# EAGLE design PCB Albert (EAGLE 9.0.1)
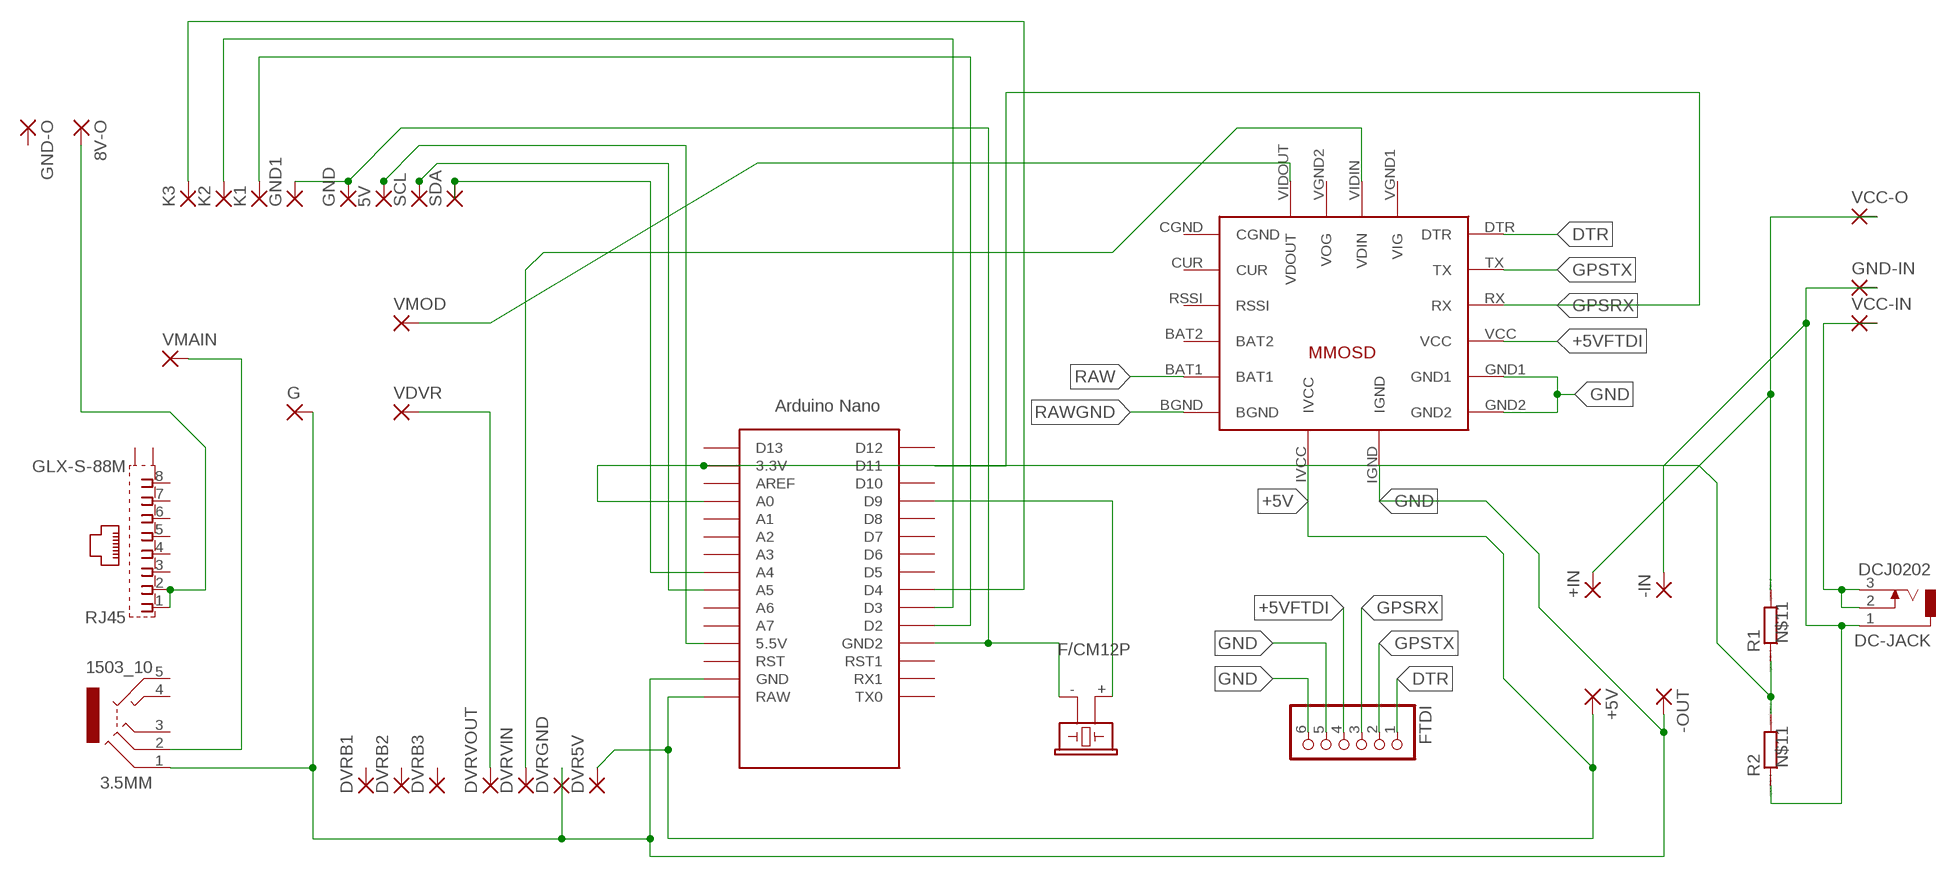
[diagram p0: schematic, sheet 1]

## Parts
3.5MM  1503_10  [1503_10]
5V  SMD2  [SMD1,27-2,54]
8V-O  2,54/1,1  [2,54/1,1]
+5V  SMD2  [SMD1,27-2,54]
+IN  SMD2  [SMD1,27-2,54]
-IN  SMD2  [SMD1,27-2,54]
-OUT  SMD2  [SMD1,27-2,54]
ADRUINO-NANO  NANO  [NANO]
BUZZ  F/CM12P  [F/CM12P]
DC-JACK  DCJ0202  [DCJ0202]
DVR5V  SMD2  [SMD1,27-2,54]
DVRB1  SMD2  [SMD1,27-2,54]
DVRB2  SMD2  [SMD1,27-2,54]
DVRB3  SMD2  [SMD1,27-2,54]
DVRGND  SMD2  [SMD1,27-2,54]
DVRVIN  SMD2  [SMD1,27-2,54]
DVRVOUT  SMD2  [SMD1,27-2,54]
FTDI  PINHD-1X6  [1X06]
G  SMD2  [SMD1,27-2,54]
GND  SMD2  [SMD1,27-2,54]
GND1  SMD2  [SMD1,27-2,54]
GND-IN  2,54/1,1  [2,54/1,1]
GND-O  2,54/1,1  [2,54/1,1]
K1  SMD2  [SMD1,27-2,54]
K2  SMD2  [SMD1,27-2,54]
K3  SMD2  [SMD1,27-2,54]
MINIMOSD  MICROMINIMOSDPWR  [MMOSDNVDVID]
R1  R0207/10  [0207/10]
R2  R0207/10  [0207/10]
RJ45  GLX-S-88M  [GLX-S-88M]
SCL  SMD2  [SMD1,27-2,54]
SDA  SMD2  [SMD1,27-2,54]
VCC-IN  2,54/1,1  [2,54/1,1]
VCC-O  2,54/1,1  [2,54/1,1]
VDVR  SMD2  [SMD1,27-2,54]
VMAIN  SMD2  [SMD1,27-2,54]
VMOD  SMD2  [SMD1,27-2,54]

## Nets
+5V: +5V.1(P) ADRUINO-NANO.RAW DVR5V.1(P) MINIMOSD.IVCC
+5VFTDI: FTDI.4 MINIMOSD.VCC
DTR: FTDI.1 MINIMOSD.DTR
GND: 3.5MM.1 -OUT.1(P) ADRUINO-NANO.GND DVRGND.1(P) FTDI.5 FTDI.6 G.1(P) MINIMOSD.GND1 MINIMOSD.GND2 MINIMOSD.IGND
GPSRX: ADRUINO-NANO.D11 FTDI.3 MINIMOSD.RX
GPSTX: FTDI.2 MINIMOSD.TX
N$1: ADRUINO-NANO.GND1(GND2) BUZZ.- GND1.1(P) GND.1(P)
N$2: 5V.1(P) ADRUINO-NANO.5V(5.5V)
N$3: ADRUINO-NANO.A5 SCL.1(P)
N$4: ADRUINO-NANO.A4 SDA.1(P)
N$5: DC-JACK.2 DC-JACK.3 VCC-IN.1(P)
N$6: 8V-O.1(P) RJ45.1 RJ45.2
N$7: ADRUINO-NANO.D2 K1.1(P)
N$8: ADRUINO-NANO.D3 K2.1(P)
N$9: ADRUINO-NANO.D4 K3.1(P)
N$10: ADRUINO-NANO.D9 BUZZ.+
N$11: -IN.1(P) DC-JACK.1 GND-IN.1(P) R2.1
N$14: DVRVOUT.1(P) VDVR.1(P)
N$15: 3.5MM.2 VMAIN.1(P)
N$17: +IN.1(P) R1.2 VCC-O.1(P)
N$18: ADRUINO-NANO.3.3V ADRUINO-NANO.A0 R1.1 R2.2
RAW: MINIMOSD.BAT1
RAWGND: MINIMOSD.BGND
VIDIN: DVRVIN.1(P) MINIMOSD.VIDIN(VDIN)
VIDOUT: MINIMOSD.VIDOUT(VDOUT) VMOD.1(P)
Unconnected: 3.5MM.3 3.5MM.4 3.5MM.5 ADRUINO-NANO.A1 ADRUINO-NANO.A2 ADRUINO-NANO.A3 ADRUINO-NANO.A6 ADRUINO-NANO.A7 ADRUINO-NANO.AREF ADRUINO-NANO.D5 ADRUINO-NANO.D6 ADRUINO-NANO.D7 ADRUINO-NANO.D8 ADRUINO-NANO.D10 ADRUINO-NANO.D12 ADRUINO-NANO.D13 ADRUINO-NANO.ICSP1 ADRUINO-NANO.ICSP2 ADRUINO-NANO.ICSP3 ADRUINO-NANO.ICSP4 ADRUINO-NANO.ICSP5 ADRUINO-NANO.ICSP6 ADRUINO-NANO.RST ADRUINO-NANO.RST1 ADRUINO-NANO.RX1 ADRUINO-NANO.TX0 DVRB1.1(P) DVRB2.1(P) DVRB3.1(P) GND-O.1(P) MINIMOSD.CUR MINIMOSD.RSSI MINIMOSD.VGND1(VIG) MINIMOSD.VGND2(VOG) RJ45.3 RJ45.4 RJ45.5 RJ45.6 RJ45.7 RJ45.8 RJ45.S1 RJ45.S2

## Power pins joined to a net without a drawn wire
BAT2: MINIMOSD.BAT2
CGND: MINIMOSD.CGND

## Library data of the parts
3.5MM = con-lumberg:1503_10: Jack connectors according to JISC 6560, 3.5 mm Klinkeneinbaukupplung, 3,5 mm, 4-polig/stereo, abgewinkelte Ausführung Source: http://www.lumberg.de/Produkte/PDFs/1503_10.pdf; OC_FARNELL: 1308868; OC_NEWARK: unknown
5V +5V +IN -IN -OUT DVR5V DVRB1-DVRB3 DVRGND DVRVIN DVRVOUT G GND GND1 K1-K3 SCL SDA VDVR VMAIN VMOD = wirepad:SMD2: SMD PAD
8V-O GND-IN GND-O VCC-IN VCC-O = wirepad:2,54/1,1: THROUGH-HOLE PAD
ADRUINO-NANO = Arduino-clone:NANO: Arduino Nano
BUZZ = buzzer:F/CM12P: BUZZER Source: Buerklin; OC_FARNELL: unknown; OC_NEWARK: unknown; SPICEPREFIX: X
DC-JACK = con-jack:DCJ0202: DC POWER JACK Source: DCJ0202.pdf; OC_FARNELL: unknown; OC_NEWARK: unknown
FTDI = pinhead:PINHD-1X6: PIN HEADER
MINIMOSD = FPVTools:MICROMINIMOSDPWR
R1 R2 = eagle-ltspice:R: RESISTOR, European symbol; SPICEMODEL: NONE; SPICEPREFIX: R
RJ45 = con-kycon:GLX-S-88M: Mod. Jack, Right Angle, 8 posiotion, 8 contatcs RJ45 Source: GLX-S-88M.pdf; OC_FARNELL: unknown; OC_NEWARK: unknown

## Net classes
0 default: width 0.762 mm, drill 0.508 mm, clearance 0.508 mm

## Board
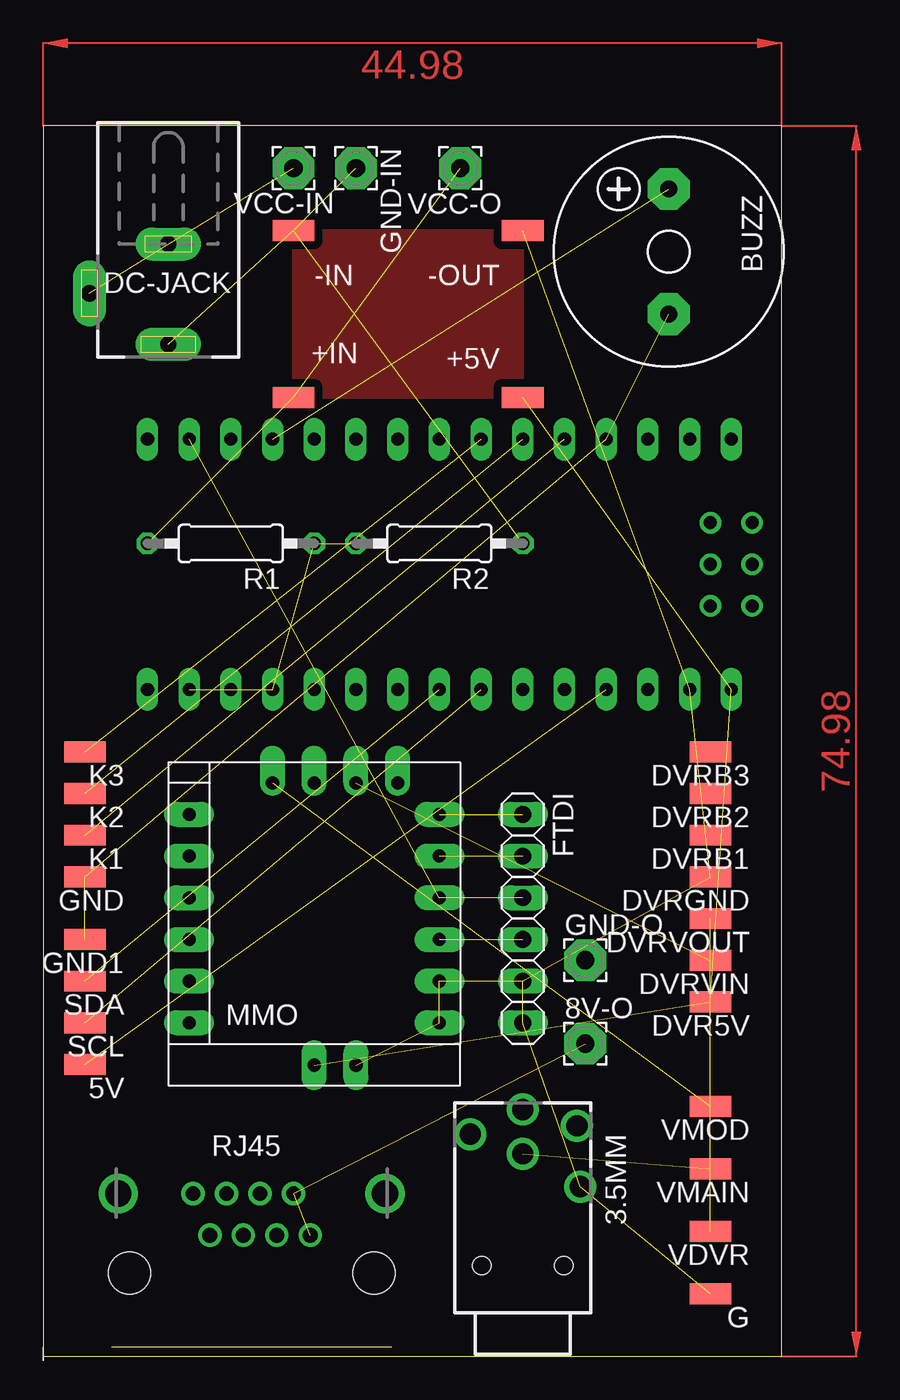
[diagram p1: board, top side]
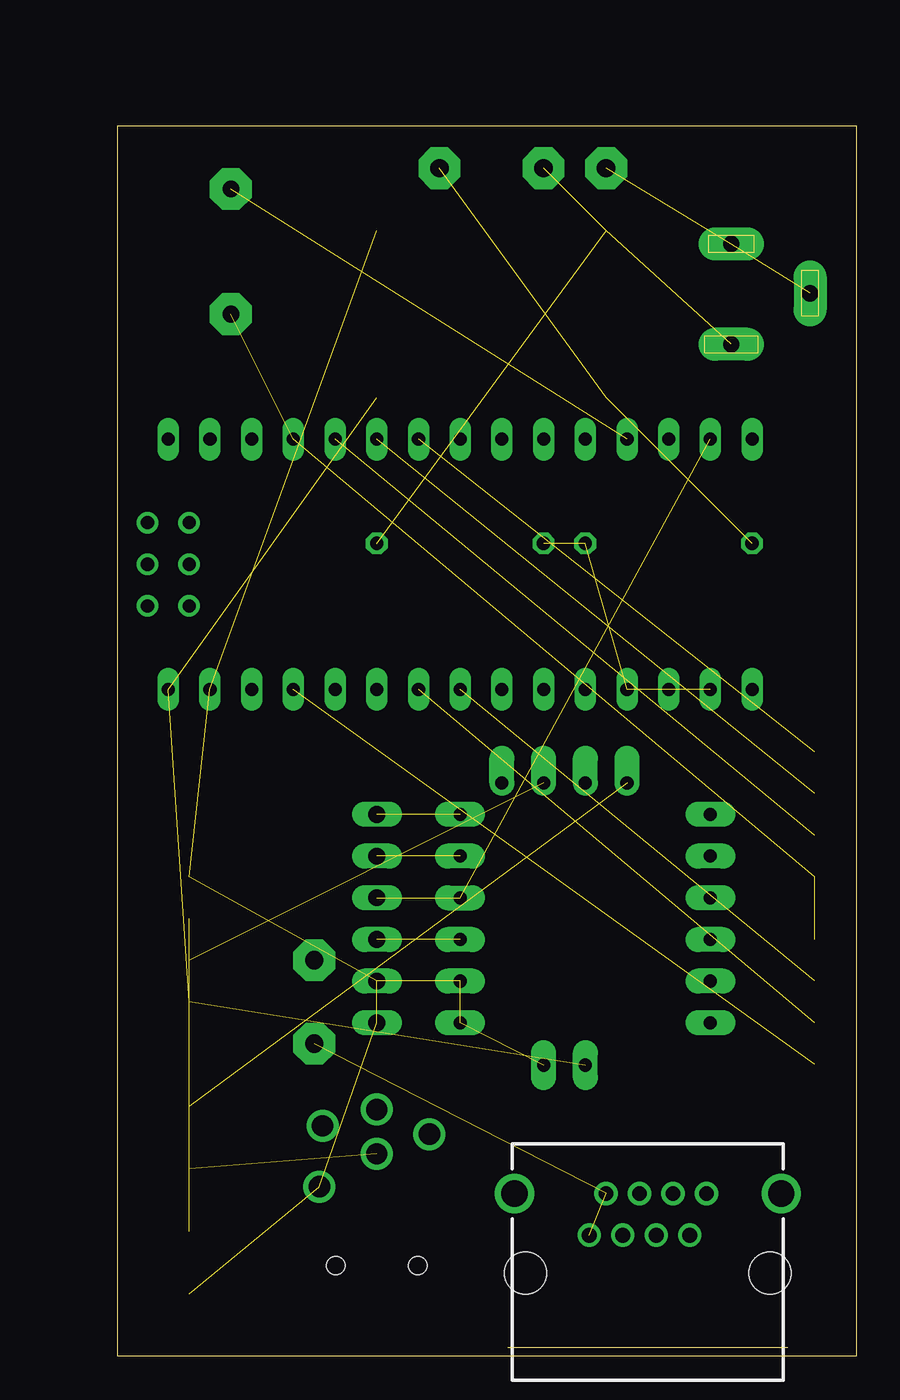
[diagram p2: board, bottom side, seen from below]

Size 44.98 x 74.98 mm. Coordinates in mm from the lower left corner, seen from the top.
Outline: 0,74.98 0,0 44.98,0 44.98,74.98 0,74.98
Copper layers (1*16): Top 0.035mm / dielectric 1.5mm / Bottom 0.035mm
Design rules "PCB Albert": minimum track width 6mil, minimum drill 0.35mm, track to track 0.205mm, track to pad 0.205mm, pad to pad 0.205mm, via to via 0.205mm, smd to smd 6mil, copper to edge 40mil, drill to drill 6mil, minimum pad ring 10mil, minimum via ring 8mil, stop-mask expansion 4mil, vias tented up to drill 0mil, thermal gap 10mil

### Footprints (pad centres in the part's own frame; a part is rotated, then mirrored left to right if it is on the bottom)
1503_10 = drill 1.3 pad 1.9: 1 -3.5,-7.8; 2 0,-9.8; 3 -3.3,-11.5; 4 3.2,-11; 5 0,-12.5 | hole 1.1: -2.5,-3; 2.5,-3
SMD1,27-2,54 = smd 1.27 x 2.54: 1 0,0
2,54/1,1 = drill 1.118 pad 2.54 octagon: 1 0,0
NANO = drill 0.8 long: 3.3V -10.16,24.13; 5V -10.16,-1.27; A0 -10.16,19.05; A1 -10.16,16.51; A2 -10.16,13.97; A3 -10.16,11.43; A4 -10.16,8.89; A5 -10.16,6.35; A6 -10.16,3.81; A7 -10.16,1.27; AREF -10.16,21.59; D2 5.08,1.27; D3 5.08,3.81; D4 5.08,6.35; D5 5.08,8.89; D6 5.08,11.43; D7 5.08,13.97; D8 5.08,16.51; D9 5.08,19.05; D10 5.08,21.59; D11 5.08,24.13; D12 5.08,26.67; D13 -10.16,26.67; GND -10.16,-6.35; GND1 5.08,-1.27; RAW -10.16,-8.89; RST -10.16,-3.81; RST1 5.08,-3.81; RX1 5.08,-6.35; TX0 5.08,-8.89 | drill 0.8: ICSP1 -5.08,-10.16; ICSP2 -5.08,-7.62; ICSP3 -2.54,-10.16; ICSP4 -2.54,-7.62; ICSP5 0,-10.16; ICSP6 0,-7.62
F/CM12P = drill 1.016 pad 2.54 octagon: + 3.81,0; - -3.81,0
DCJ0202 = drill 1 pad 2 long: 1 0,3.1; 2 4.8,0; 3 0,-3
1X06 = drill 1.016 long: 1 -6.35,0; 2 -3.81,0; 3 -1.27,0; 4 1.27,0; 5 3.81,0; 6 6.35,0
MMOSDNVDVID = drill 0.8 pad 1.524 long: BAT1 -7.62,-3.81; BAT2 -7.62,-1.27; BGND -7.62,-6.35; CGND -7.62,3.81; CUR -7.62,6.35; DTR 7.62,6.35; GND1 7.62,-3.81; GND2 7.62,-6.35; IGND 2.54,-8.93; IVCC 0,-8.93; RSSI -7.62,1.27; RX 7.62,1.27; TX 7.62,3.81; VCC 7.62,-1.27 | drill 0.8 pad 1.524 offset: VGND1 0,8.255; VGND2 5.08,8.255; VIDIN 2.54,8.255; VIDOUT -2.54,8.255
0207/10 = drill 0.813 octagon: 1 -5.08,0; 2 5.08,0
GLX-S-88M = drill 0.9 pad 1.422: 1 -3.57,-2.3; 2 -2.55,-4.84; 3 -1.53,-2.3; 4 -0.51,-4.84; 5 0.51,-2.3; 6 1.53,-4.84; 7 2.55,-2.3; 8 3.57,-4.84 | drill 1.6 pad 2.184: S1 -8.125,-4.84; S2 8.125,-4.84 | hole 2.55: -7.44,0; 7.44,0

### Placement (x,y rotation side)
3.5MM  29.21,2.54 180 top
5V  2.54,17.78 90 top
8V-O  33.02,19.05 0 top
+5V  29.21,58.42 90 top
+IN  15.24,58.42 270 top
-IN  15.24,68.58 90 top
-OUT  29.21,68.58 90 top
ADRUINO-NANO  33.02,50.8 90 top
BUZZ  38.1,67.31 90 top
DC-JACK  7.62,64.77 180 top
DVR5V  40.64,21.59 90 top
DVRB1  40.64,31.75 90 top
DVRB2  40.64,34.29 90 top
DVRB3  40.64,36.83 90 top
DVRGND  40.64,29.21 90 top
DVRVIN  40.64,24.13 90 top
DVRVOUT  40.64,26.67 90 top
FTDI  29.21,26.67 270 top
G  40.64,3.81 90 top
GND  2.54,29.21 90 top
GND1  2.54,25.4 90 top
GND-IN  19.05,72.39 180 top
GND-O  33.02,24.13 0 top
K1  2.54,31.75 90 top
K2  2.54,34.29 90 top
K3  2.54,36.83 90 top
MINIMOSD  16.51,26.67 0 top
R1  11.43,49.53 180 top
R2  24.13,49.53 180 top
RJ45  12.7,5.08 180 top
SCL  2.54,20.32 90 top
SDA  2.54,22.86 90 top
VCC-IN  15.24,72.39 90 top
VCC-O  25.4,72.39 90 top
VDVR  40.64,7.62 90 top
VMAIN  40.64,11.43 90 top
VMOD  40.64,15.24 90 top

### Tracks (layer width: path | path; a pad name or v marks a point on that pad's centre or on a via)
+5V  (3 unrouted)
+5VFTDI  (1 unrouted)
DTR  (1 unrouted)
GND  (9 unrouted)
GPSRX  (2 unrouted)
GPSTX  (1 unrouted)
N$1  (3 unrouted)
N$2  (1 unrouted)
N$3  (1 unrouted)
N$4  (1 unrouted)
N$5  (2 unrouted)
N$6  (2 unrouted)
N$7  (1 unrouted)
N$8  (1 unrouted)
N$9  (1 unrouted)
N$10  (1 unrouted)
N$11  (3 unrouted)
N$13
  pour Top: 15.24,68.58 29.21,68.58 29.21,58.42 15.24,58.42
N$14  (1 unrouted)
N$15  (1 unrouted)
N$17  (2 unrouted)
N$18  (3 unrouted)
VIDIN  (1 unrouted)
VIDOUT  (1 unrouted)
(copper drawn outside any net)
  shapes: Top area x2

### Text on the board
tStop: Arduino NANO